# EAGLE design POE_RS-485 (EAGLE 6.5.0)
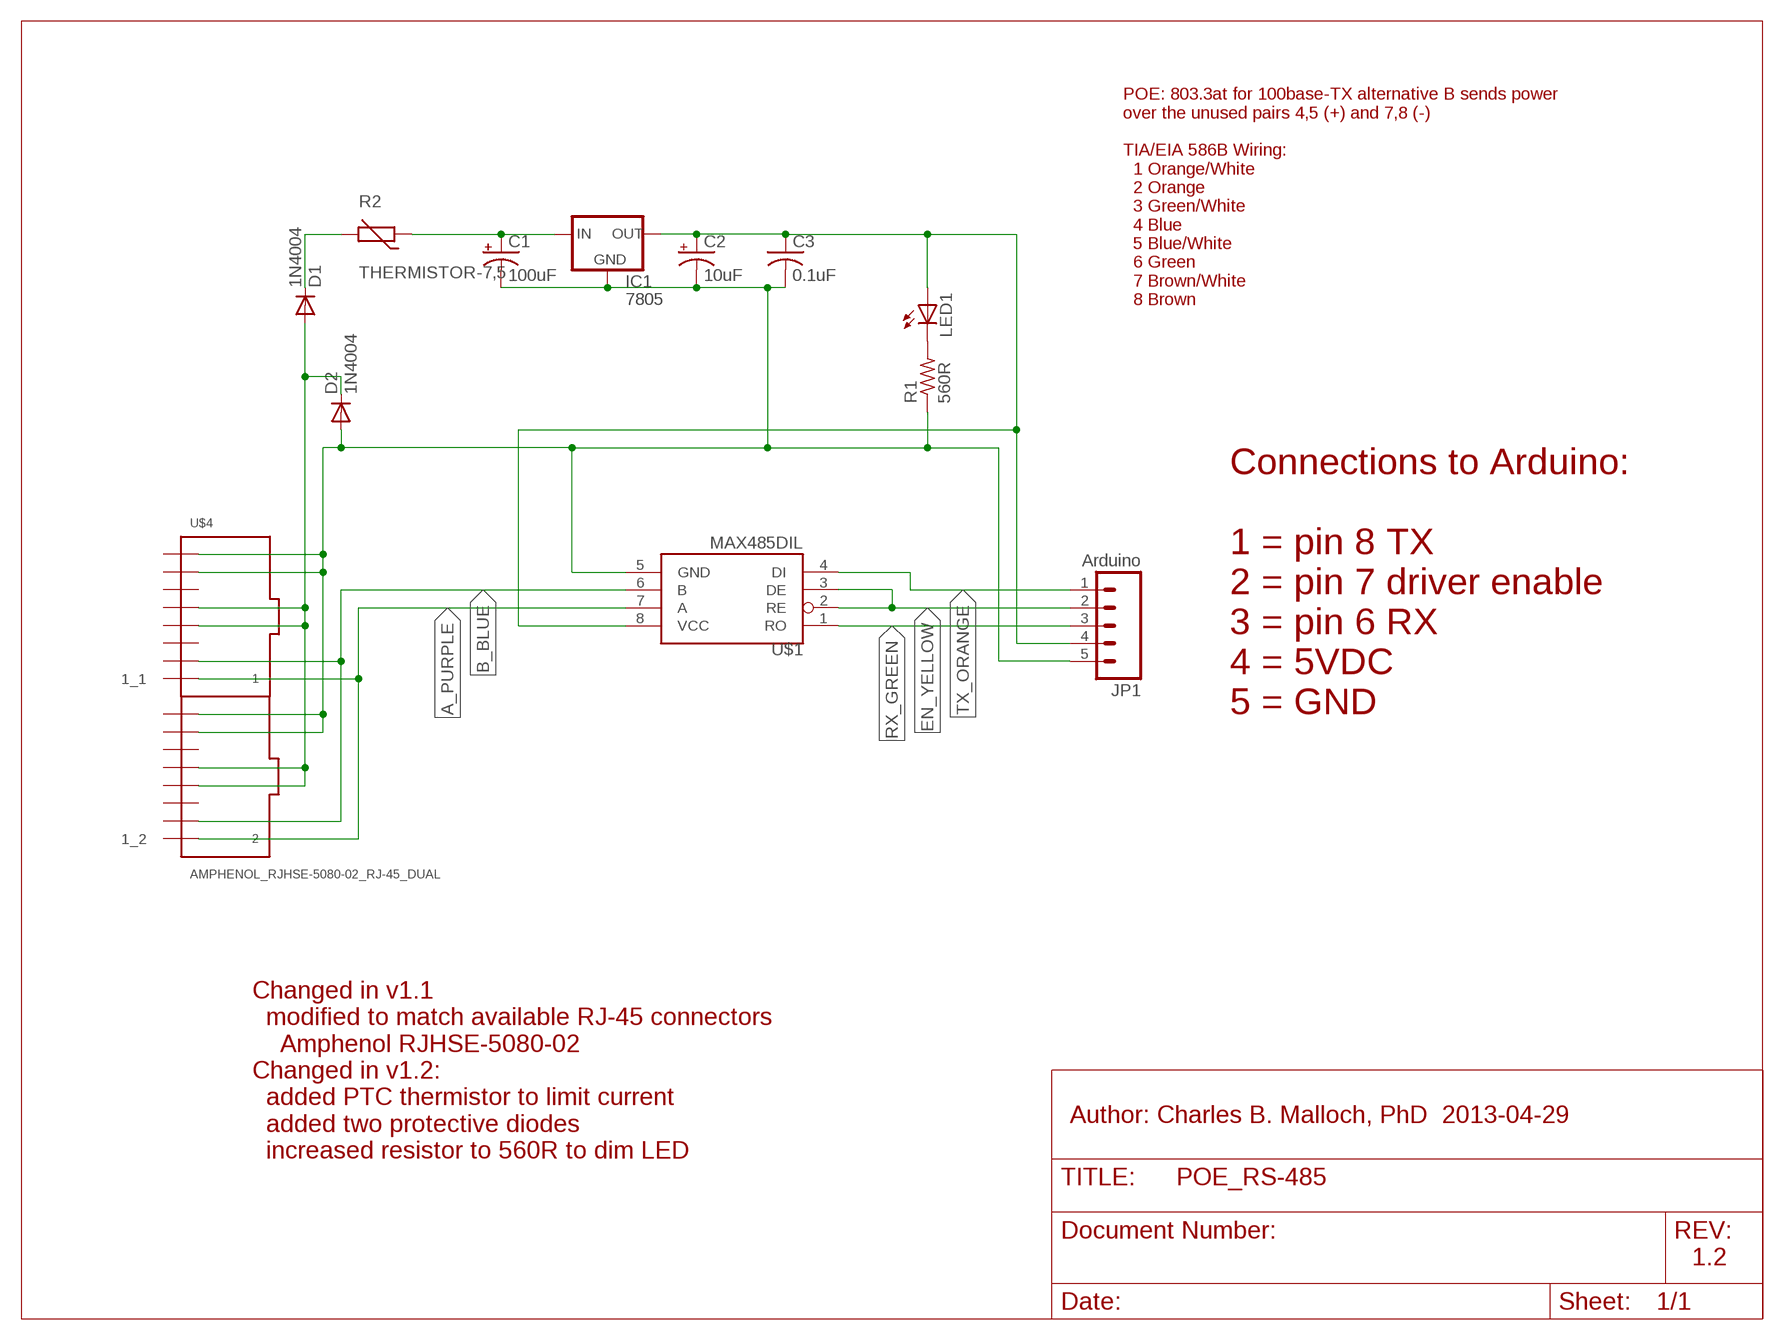
[diagram p0: schematic, sheet 1]

## Parts
C1  100uF  CPOL-USTT2D7  [TT2D7]
C2  10uF  CPOL-USE1.8-4  [E1,8-4]
C3  0.1uF  C-US025-025X050  [C025-025X050]
D1  1N4004  [DO41-10]
D2  1N4004  [DO41-10]
IC1  7805  V_REG_78XX-TO-220  [TO-220-ALT]
JP1  Arduino  M05LOCK_LONGPADS  [1X05_LOCK_LONGPADS]
LED1  LED3MM  [LED3MM]
R1  560R  R-US_0204/7  [0204/7]
R2  THERMISTOR-7,5  [R-7,5]
U$1  MAX485DIL  [DIL08]
U$4  AMPHENOL_RJHSE-5080-02_RJ-45_DUAL  [AMPHENOL_RJHSE-5080-02]

## Nets
A_PURPLE: U$1.7(A) U$4.TX_D1+_2(1_2) U$4.TX_DI+_1(1_1)
B_BLUE: U$1.6(B) U$4.TX_D1-_2(2_2) U$4.TX_DI-_1(2_1)
EN_YELLOW: JP1.2 U$1.2(RE) U$1.3(DE)
GND [POWER]: C1.- C2.- C3.2 D2.A IC1.GND JP1.5 R1.1 U$1.5(GND) U$4.POE-_1_1(7_1) U$4.POE-_1_2(7_2) U$4.POE-_2_1(8_1) U$4.POE-_2_2(8_2)
N$1: LED1.K(C) R1.2
N$3 [POWER]: C1.+ IC1.IN R2.1
N$4 [POWER]: D1.C R2.2
PWR [POWER]: C2.+ C3.1 IC1.OUT JP1.4 LED1.A U$1.8(VCC)
RX_GREEN: JP1.3 U$1.1(RO)
TX_ORANGE: JP1.1 U$1.4(DI)
VIN [POWER]: D1.A D2.C U$4.POE+_1_1(4_1) U$4.POE+_1_2(4_2) U$4.POE+_2_1(5_1) U$4.POE+_2_2(5_2)
Unconnected: U$4.RX_D2+_1(3_1) U$4.RX_D2+_2(3_2) U$4.RX_D2-_1(6_1) U$4.RX_D2-_2(6_2)

## Notes on the sheet
- POE: 803.3at for 100base-TX alternative B sends power 
  over the unused pairs 4,5 (+) and 7,8 (-)
  
  TIA/EIA 586B Wiring:
    1 Orange/White
    2 Orange
    3 Green/White
    4 Blue
    5 Blue/White
    6 Green
    7 Brown/White
    8 Brown
- Connections to Arduino:
  
  1 = pin 8 TX
  2 = pin 7 driver enable
  3 = pin 6 RX
  4 = 5VDC
  5 = GND
- Author: Charles B. Malloch, PhD  2013-04-29
- Changed in v1.1
    modified to match available RJ-45 connectors
      Amphenol RJHSE-5080-02
  Changed in v1.2:
    added PTC thermistor to limit current
    added two protective diodes 
    increased resistor to 560R to dim LED
- 1.2

## Library data of the parts
C1 C2 = adafruit:CPOL-US: POLARIZED CAPACITOR, American symbol
C3 = adafruit:C-US: CAPACITOR, American symbol
D1 D2 = diode:1N4004: DIODE general purpose rectifier, 1 A
IC1 = SparkFun-PowerIC:V_REG_78XX: Voltage Regulator Standard 7805 5V regulator. IGO (Input Ground Output). Spark Fun Electronics SKU : COM-00107
JP1 = SparkFun-Connectors:M05: Header 5 Standard 5-pin 0.1" header. Use with straight break away headers (SKU : PRT-00116), right angle break away headers (PRT-00553), swiss pins (PRT-00743), machine pins (PRT-00117), and female headers (PRT-00115). Molex polarized connector foot print use with SKU : PRT-08230 with associated crimp pins and housings.
LED1 = led:LED: LED OSRAM: - CHIPLED LG R971, LG N971, LY N971, LG Q971, LY Q971, LO R971, LY R971 LH N974, LH R974 LS Q976, LO Q976, LY Q976 LO Q996 - Hyper CHIPLED LW Q18S LB Q993, LB Q99A, LB R99A - SideLED LS A670, LO A670, LY A670, LG A670, LP A670 LB A673, LV A673, LT A673, LW A673 LH A674 LY A675 LS A676, LA A676, LO A676, LY A676, LW A676 LS A679, LY A679, LG A679 - Hyper Micro SIDELED® LS Y876, LA Y876, LO Y876, LY Y876 LT Y87S - SmartLED LW L88C, LW L88S LB L89C, LB L89S, LG L890 LS L89K, LO L89K, LY L89K LS L896, LA L896, LO L896, LY L896 - TOPLED LS T670, LO T670, LY T670, LG T670, LP T670 LSG T670, LSP T670, LSY T670, LOP T670, LYG T670 LG T671, LOG T671, LSG T671 LB T673, LV T673, LT T673, LW T673 LH T674 LS T676, LA T676, LO T676, LY T676, LB T676, LH T676, LSB T676, LW T676 LB T67C, LV T67C, LT T67C, LS T67K, LO T67K, LY T67K, LW E67C LS E67B, LA E67B, LO E67B, LY E67B, LB E67C, LV E67C, LT E67C LW T67C LS T679, LY T679, LG T679 LS T770, LO T770, LY T770, LG T770, LP T770 LB T773, LV T773, LT T773, LW T773 LH T774 LS E675, LA E675, LY E675, LS T675 LS T776, LA T776, LO T776, LY T776, LB T776 LHGB T686 LT T68C, LB T68C - Hyper Mini TOPLED® LB M676 - Mini TOPLED Santana® LG M470 LS M47K, LO M47K, LY M47K Source: http://www.osram.convergy.de LUXEON: - LUMILED® LXK2-PW12-R00, LXK2-PW12-S00, LXK2-PW14-U00, LXK2-PW14-V00 LXK2-PM12-R00, LXK2-PM12-S00, LXK2-PM14-U00 LXK2-PE12-Q00, LXK2-PE12-R00, LXK2-PE12-S00, LXK2-PE14-T00, LXK2-PE14-U00 LXK2-PB12-K00, LXK2-PB12-L00, LXK2-PB12-M00, LXK2-PB14-N00, LXK2-PB14-P00, LXK2-PB14-Q00 LXK2-PR12-L00, LXK2-PR12-M00, LXK2-PR14-Q00, LXK2-PR14-R00 LXK2-PD12-Q00, LXK2-PD12-R00, LXK2-PD12-S00 LXK2-PH12-R00, LXK2-PH12-S00 LXK2-PL12-P00, LXK2-PL12-Q00, LXK2-PL12-R00 Source: www.luxeon.com KINGBRIGHT: KA-3528ASYC Source: www.kingbright.com
R1 = resistor:R-US_: RESISTOR, American symbol
R2 = varistor:THERMISTOR: THERMISTOR
U$1 = SparkFun-DigitalIC:MAX485: RS-485 transceiver
U$4 = cbm_parts:AMPHENOL_RJHSE-5080-02_RJ-45_DUAL: Amphenol RJHSE-5080-02 RJ-45 dual

## Net classes
1 POWER: width 0.61 mm, clearance 0.305 mm

## Board
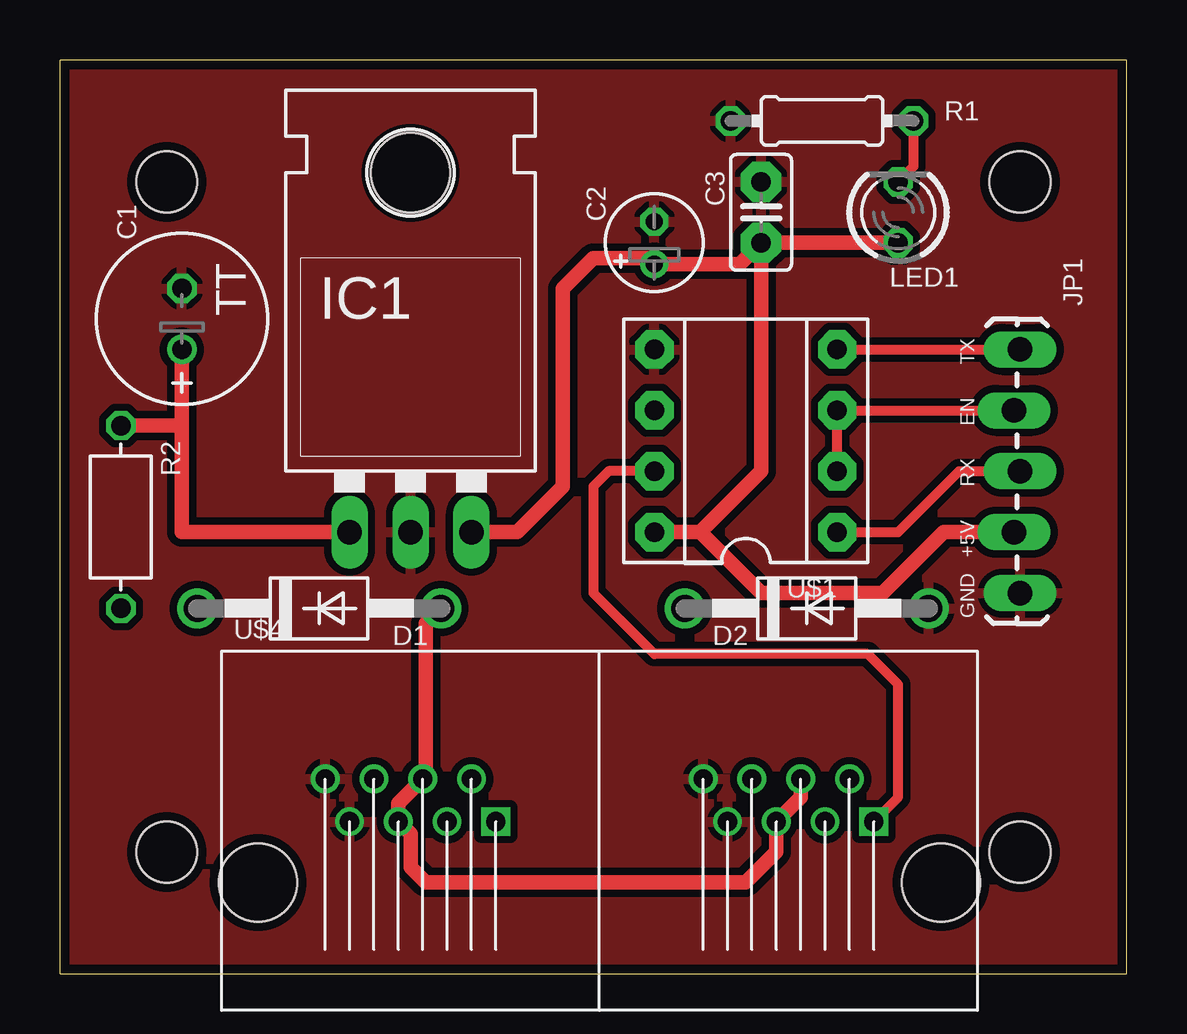
[diagram p1: board, top side]
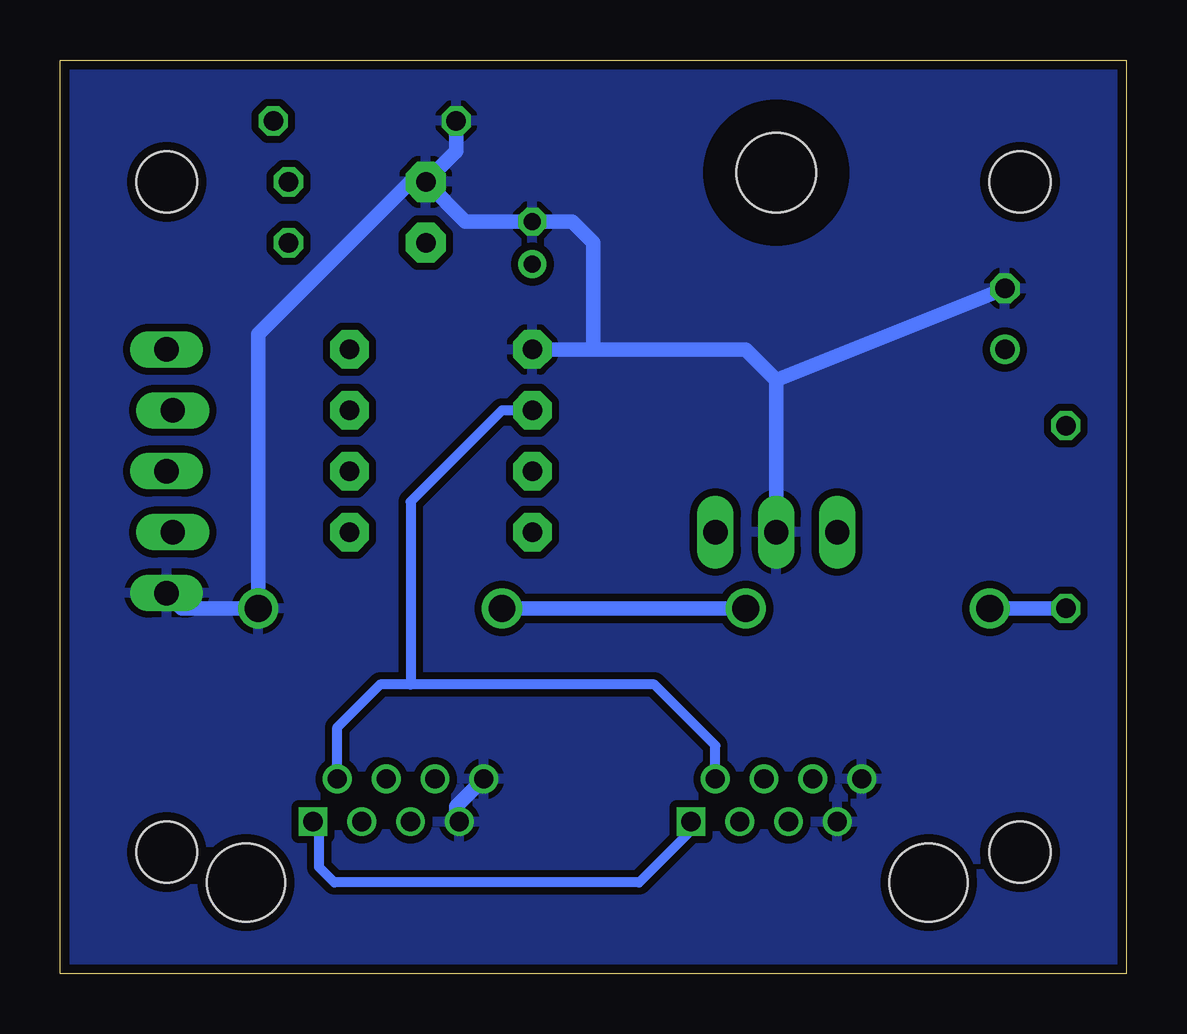
[diagram p2: board, bottom side, seen from below]

Size 44.45 x 38.1 mm. Coordinates in mm from the lower left corner, seen from the top.
Outline: 0,0 44.45,0 44.45,38.1 0,38.1 0,0
Copper layers (1*16): Top 0.0356mm / dielectric 1.5011mm / Bottom 0.0356mm
Design rules "LaenPCBOrder": minimum track width 6mil, minimum drill 13mil, track to track 6mil, track to pad 6mil, pad to pad 6mil, via to via 6mil, smd to smd 6mil, copper to edge 15mil, drill to drill 6mil, minimum pad ring 7mil, minimum via ring 7mil, stop-mask expansion 4mil, vias tented up to drill 0mil, thermal gap 10mil
Holes 2.54 mm at 4.45,5.08 40.01,5.08 40.01,33.02 4.45,33.02

### Footprints (pad centres in the part's own frame; a part is rotated, then mirrored left to right if it is on the bottom)
TT2D7 = drill 0.813: + -1.27,0 | drill 0.813 octagon: - 1.27,0
E1,8-4 = drill 0.711 pad 1.168: + -0.889,0 | drill 0.711 pad 1.168 octagon: - 0.889,0
C025-025X050 = drill 0.813 pad 1.676 octagon: 1 -1.27,0; 2 1.27,0
DO41-10 = drill 1.118: A 5.08,0; C -5.08,0
TO-220-ALT = drill 1.016 long: GND 0,-3.81; IN -2.54,-3.81; OUT 2.54,-3.81 | hole 3.302: 0,11.176
1X05_LOCK_LONGPADS = drill 1.016 long: 1 0,0; 2 2.54,-0.254; 3 5.08,0; 4 7.62,-0.254; 5 10.16,0
LED3MM = drill 0.813 octagon: A -1.27,0; K 1.27,0
0204/7 = drill 0.813 octagon: 1 -3.81,0; 2 3.81,0
R-7,5 = drill 0.813 octagon: 1 -3.81,0; 2 3.81,0
DIL08 = drill 0.813 pad 1.6 octagon: 1 -3.81,-3.81; 2 -1.27,-3.81; 3 1.27,-3.81; 4 3.81,-3.81; 5 3.81,3.81; 6 1.27,3.81; 7 -1.27,3.81; 8 -3.81,3.81
AMPHENOL_RJHSE-5080-02 = drill 0.8: POE+_1_1 0.508,1.778; POE+_1_2 16.256,1.778; POE+_2_1 -0.508,0; POE+_2_2 15.24,0; POE-_1_1 -2.54,0; POE-_1_2 13.208,0; POE-_2_1 -3.556,1.778; POE-_2_2 12.192,1.778; RX_D2+_1 1.524,0; RX_D2+_2 17.272,0; RX_D2-_1 -1.524,1.778; RX_D2-_2 14.224,1.778; TX_D1-_2 18.288,1.778; TX_DI-_1 2.54,1.778 | drill 0.8 square: TX_D1+_2 19.304,0; TX_DI+_1 3.556,0 | hole 3.251: -6.35,-2.54; 22.098,-2.54

### Placement (x,y rotation side)
C1  5.08,27.3 90 top
C2  24.77,30.48 90 top
C3  29.21,31.75 90 top
D1  10.79,15.24 0 top
D2  31.11,15.24 0 top
IC1  14.61,22.23 0 top
JP1  40.01,26.04 270 top
LED1  34.92,31.75 90 top
R1  31.75,35.56 0 top
R2  2.54,19.05 270 top
U$1  28.57,22.23 90 top
U$4  14.61,6.35 0 top

### Tracks (layer width: path | path; a pad name or v marks a point on that pad's centre or on a via)
A_PURPLE
  Top 0.406: U$1.7 22.86,20.95 22.23,20.32 22.23,15.88 24.77,13.34 33.66,13.34 34.92,12.06 34.92,7.37 U$4.TX_D1+_2
  Bottom 0.406: U$4.TX_DI+_1 18.16,5.97 20.32,3.81 33.02,3.81 33.66,4.45 33.66,6.1 U$4.TX_D1+_2
B_BLUE
  Bottom 0.406: U$1.6 26.04,23.5 29.84,19.68 29.84,12.06 | U$4.TX_DI-_1 17.14,9.53 19.68,12.06 29.84,12.06 | 29.84,12.06 31.11,12.06 32.89,10.29 U$4.TX_D1-_2
EN_YELLOW
  Top 0.406: U$1.2 U$1.3 JP1.2
GND
  Bottom 0.61: U$1.5 22.23,26.04 | 22.23,26.04 15.88,26.04 14.61,24.77 | 14.61,24.77 IC1.GND | C1.- 14.61,24.77 | 22.23,26.04 22.23,30.48 23.11,31.37 C2.- 27.56,31.37 C3.2 | R1.1 27.94,34.29 C3.2 | JP1.5 39.37,15.24 D2.A 36.2,26.67 29.84,33.02 C3.2 | U$4.POE-_1_2 27.94,6.35 27.94,6.99 U$4.POE-_2_2
  pour Top: 0,0 0,38.1 44.45,38.1 44.45,0
  pour Bottom: 0,0 0,38.1 44.45,38.1 44.45,0
N$1
  Top 0.406: R1.2 35.56,33.66 LED1.K
N$3
  Top 0.61: IC1.IN 5.08,18.41 5.08,22.86 | C1.+ 5.08,22.86 | R2.1 5.08,22.86
N$4
  Bottom 0.61: D1.C R2.2
PWR
  Top 0.61: C3.1 28.32,29.59 C2.+ 24.51,29.84 22.23,29.84 20.95,28.57 20.95,20.32 19.05,18.41 IC1.OUT | LED1.A C3.1 | U$1.8 26.67,18.41 | 26.67,18.41 29.21,20.95 C3.1 | 26.67,18.41 29.21,15.88 34.29,15.88 36.83,18.41 JP1.4
RX_GREEN
  Top 0.406: JP1.3 37.47,20.95 34.92,18.41 U$1.1
TX_ORANGE
  Top 0.406: U$1.4 JP1.1
VIN
  Top 0.61: U$4.POE+_1_2 30.86,7.37 U$4.POE+_2_2 29.84,5.08 28.57,3.81 15.24,3.81 14.61,4.45 14.61,5.84 U$4.POE+_2_1 14.1,7.11 U$4.POE+_1_1 15.24,8.26 15.24,14.61 D1.A
  Bottom 0.61: D2.C D1.A

### Text on the board
tNames: TX | EN | RX | +5V | GND
bValues: POE_RS-485 v1.2 | cbm Electronics